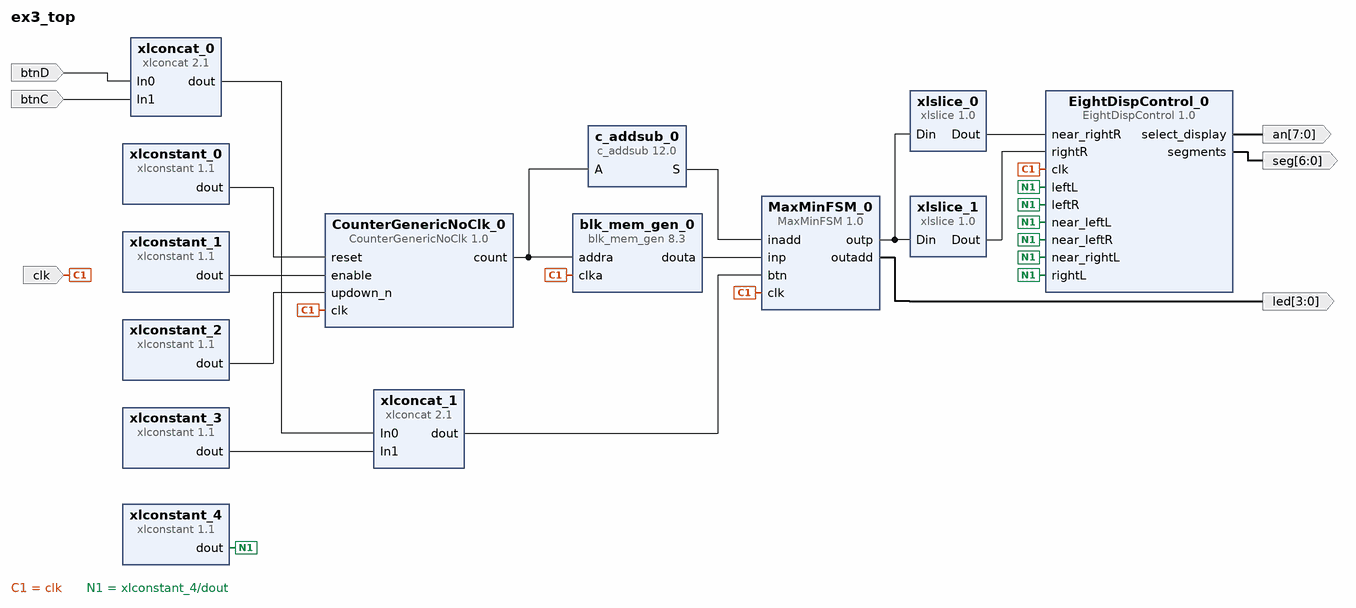
[diagram p0: block diagram of the top level]
# Vivado block design ex3_top, xc7a100tcsg324-3, Vivado 2016.4
create_bd_design ex3_top

create_bd_port -dir I clk
create_bd_port -dir I btnC
create_bd_port -dir I btnD
create_bd_port -dir O -from 3 -to 0 led
create_bd_port -dir O -from 7 -to 0 an
create_bd_port -dir O -from 6 -to 0 seg

create_bd_cell -type ip -vlnv xilinx.com:user:MaxMinFSM:1.0 MaxMinFSM_0
create_bd_cell -type ip -vlnv xilinx.com:ip:blk_mem_gen:8.3 blk_mem_gen_0
set_property -dict [list \
  CONFIG.Memory_Type Single_Port_ROM \
  CONFIG.Enable_32bit_Address false \
  CONFIG.Write_Width_A 8 \
  CONFIG.Enable_A Always_Enabled \
  CONFIG.Register_PortA_Output_of_Memory_Primitives true \
  CONFIG.Load_Init_File true \
  CONFIG.Coe_File ../../../../../../../ex1/vector16_8bits_random.coe \
  CONFIG.Use_RSTA_Pin false \
  CONFIG.Port_A_Write_Rate 0 \
  CONFIG.use_bram_block Stand_Alone \
] [get_bd_cells blk_mem_gen_0]
create_bd_cell -type ip -vlnv xilinx.com:user:CounterGenericNoClk:1.0 CounterGenericNoClk_0
create_bd_cell -type ip -vlnv xilinx.com:ip:xlconstant:1.1 xlconstant_0
set_property -dict {CONFIG.CONST_VAL 0} [get_bd_cells xlconstant_0]
create_bd_cell -type ip -vlnv xilinx.com:ip:xlconstant:1.1 xlconstant_1
create_bd_cell -type ip -vlnv xilinx.com:ip:xlconstant:1.1 xlconstant_2
set_property -dict {CONFIG.CONST_VAL 0} [get_bd_cells xlconstant_2]
create_bd_cell -type ip -vlnv xilinx.com:ip:xlconstant:1.1 xlconstant_3
set_property -dict {CONFIG.CONST_WIDTH 2 CONFIG.CONST_VAL 0} [get_bd_cells xlconstant_3]
create_bd_cell -type ip -vlnv xilinx.com:ip:xlconcat:2.1 xlconcat_0
create_bd_cell -type ip -vlnv xilinx.com:ip:xlconcat:2.1 xlconcat_1
create_bd_cell -type ip -vlnv ua.pt:user:EightDispControl:1.0 EightDispControl_0
create_bd_cell -type ip -vlnv xilinx.com:ip:xlslice:1.0 xlslice_0
set_property -dict {CONFIG.DOUT_WIDTH 4 CONFIG.DIN_TO 4 CONFIG.DIN_FROM 7 CONFIG.DIN_WIDTH 8} [get_bd_cells xlslice_0]
create_bd_cell -type ip -vlnv xilinx.com:ip:xlslice:1.0 xlslice_1
set_property -dict {CONFIG.DOUT_WIDTH 4 CONFIG.DIN_TO 0 CONFIG.DIN_FROM 3 CONFIG.DIN_WIDTH 8} [get_bd_cells xlslice_1]
create_bd_cell -type ip -vlnv xilinx.com:ip:xlconstant:1.1 xlconstant_4
set_property -dict {CONFIG.CONST_WIDTH 4 CONFIG.CONST_VAL 0} [get_bd_cells xlconstant_4]
create_bd_cell -type ip -vlnv xilinx.com:ip:c_addsub:12.0 c_addsub_0
set_property -dict [list \
  CONFIG.A_Type Signed \
  CONFIG.B_Type Signed \
  CONFIG.A_Width 4 \
  CONFIG.B_Width 4 \
  CONFIG.Add_Mode Subtract \
  CONFIG.Out_Width 4 \
  CONFIG.Latency 0 \
  CONFIG.B_Constant true \
  CONFIG.B_Value 0010 \
  CONFIG.CE false \
] [get_bd_cells c_addsub_0]

# ---- connections ----

connect_bd_net [get_bd_ports clk] \
  [get_bd_pins MaxMinFSM_0/clk] [get_bd_pins CounterGenericNoClk_0/clk] [get_bd_pins blk_mem_gen_0/clka] \
  [get_bd_pins EightDispControl_0/clk]
connect_bd_net [get_bd_pins xlconstant_0/dout] [get_bd_pins CounterGenericNoClk_0/reset]
connect_bd_net [get_bd_pins xlconstant_1/dout] [get_bd_pins CounterGenericNoClk_0/enable]
connect_bd_net [get_bd_pins xlconstant_2/dout] [get_bd_pins CounterGenericNoClk_0/updown_n]
connect_bd_net [get_bd_pins blk_mem_gen_0/douta] [get_bd_pins MaxMinFSM_0/inp]
connect_bd_net [get_bd_ports btnD] [get_bd_pins xlconcat_0/In0]
connect_bd_net [get_bd_ports btnC] [get_bd_pins xlconcat_0/In1]
connect_bd_net [get_bd_pins xlconcat_0/dout] [get_bd_pins xlconcat_1/In0]
connect_bd_net [get_bd_pins xlconstant_3/dout] [get_bd_pins xlconcat_1/In1]
connect_bd_net [get_bd_pins xlconcat_1/dout] [get_bd_pins MaxMinFSM_0/btn]
connect_bd_net [get_bd_pins MaxMinFSM_0/outadd] [get_bd_ports led]
connect_bd_net [get_bd_pins MaxMinFSM_0/outp] [get_bd_pins xlslice_0/Din] [get_bd_pins xlslice_1/Din]
connect_bd_net [get_bd_pins xlslice_0/Dout] [get_bd_pins EightDispControl_0/near_rightR]
connect_bd_net [get_bd_pins xlslice_1/Dout] [get_bd_pins EightDispControl_0/rightR]
connect_bd_net [get_bd_pins xlconstant_4/dout] \
  [get_bd_pins EightDispControl_0/leftL] [get_bd_pins EightDispControl_0/near_leftL] \
  [get_bd_pins EightDispControl_0/near_rightL] [get_bd_pins EightDispControl_0/rightL] [get_bd_pins EightDispControl_0/leftR] \
  [get_bd_pins EightDispControl_0/near_leftR]
connect_bd_net [get_bd_pins EightDispControl_0/segments] [get_bd_ports seg]
connect_bd_net [get_bd_pins EightDispControl_0/select_display] [get_bd_ports an]
connect_bd_net [get_bd_pins c_addsub_0/S] [get_bd_pins MaxMinFSM_0/inadd]
connect_bd_net [get_bd_pins CounterGenericNoClk_0/count] [get_bd_pins c_addsub_0/A] [get_bd_pins blk_mem_gen_0/addra]

validate_bd_design
save_bd_design
